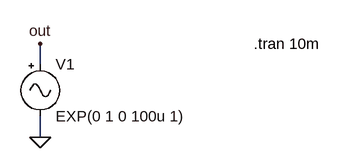
[diagram p0: schematic FFT_tests.asc]
FFT_tests.asc, the LTspice schematic file:
Version 4
SHEET 1 880 680
WIRE 16 144 16 112
WIRE 16 256 16 224
FLAG 16 256 0
FLAG 16 112 out
SYMBOL Misc\\signal 16 128 R0
WINDOW 123 0 0 Left 0
WINDOW 39 0 0 Left 0
SYMATTR InstName V1
SYMATTR Value EXP(0 1 0 100u 1)
TEXT 344 112 Left 2 !.tran 10m

The netlist it stands for:
* FFT_tests.asc
V1 out 0 EXP(0 1 0 100u 1)
.tran 10m
.backanno
.end